# Altium schematic sheet 13 CPU_1.SchDoc
size 420 x 297 mm; Address1: Address1; Address2: Address2; Address3: Address3; Address4: Address4; DocumentNumber: АБВГ.123456.001 Э3; SheetNumber: 13; SheetTotal: 23; Scale: 1:1; DocumentType: Схема электрическая принципиальная; FirstReferrence: АБВГ.123456.001
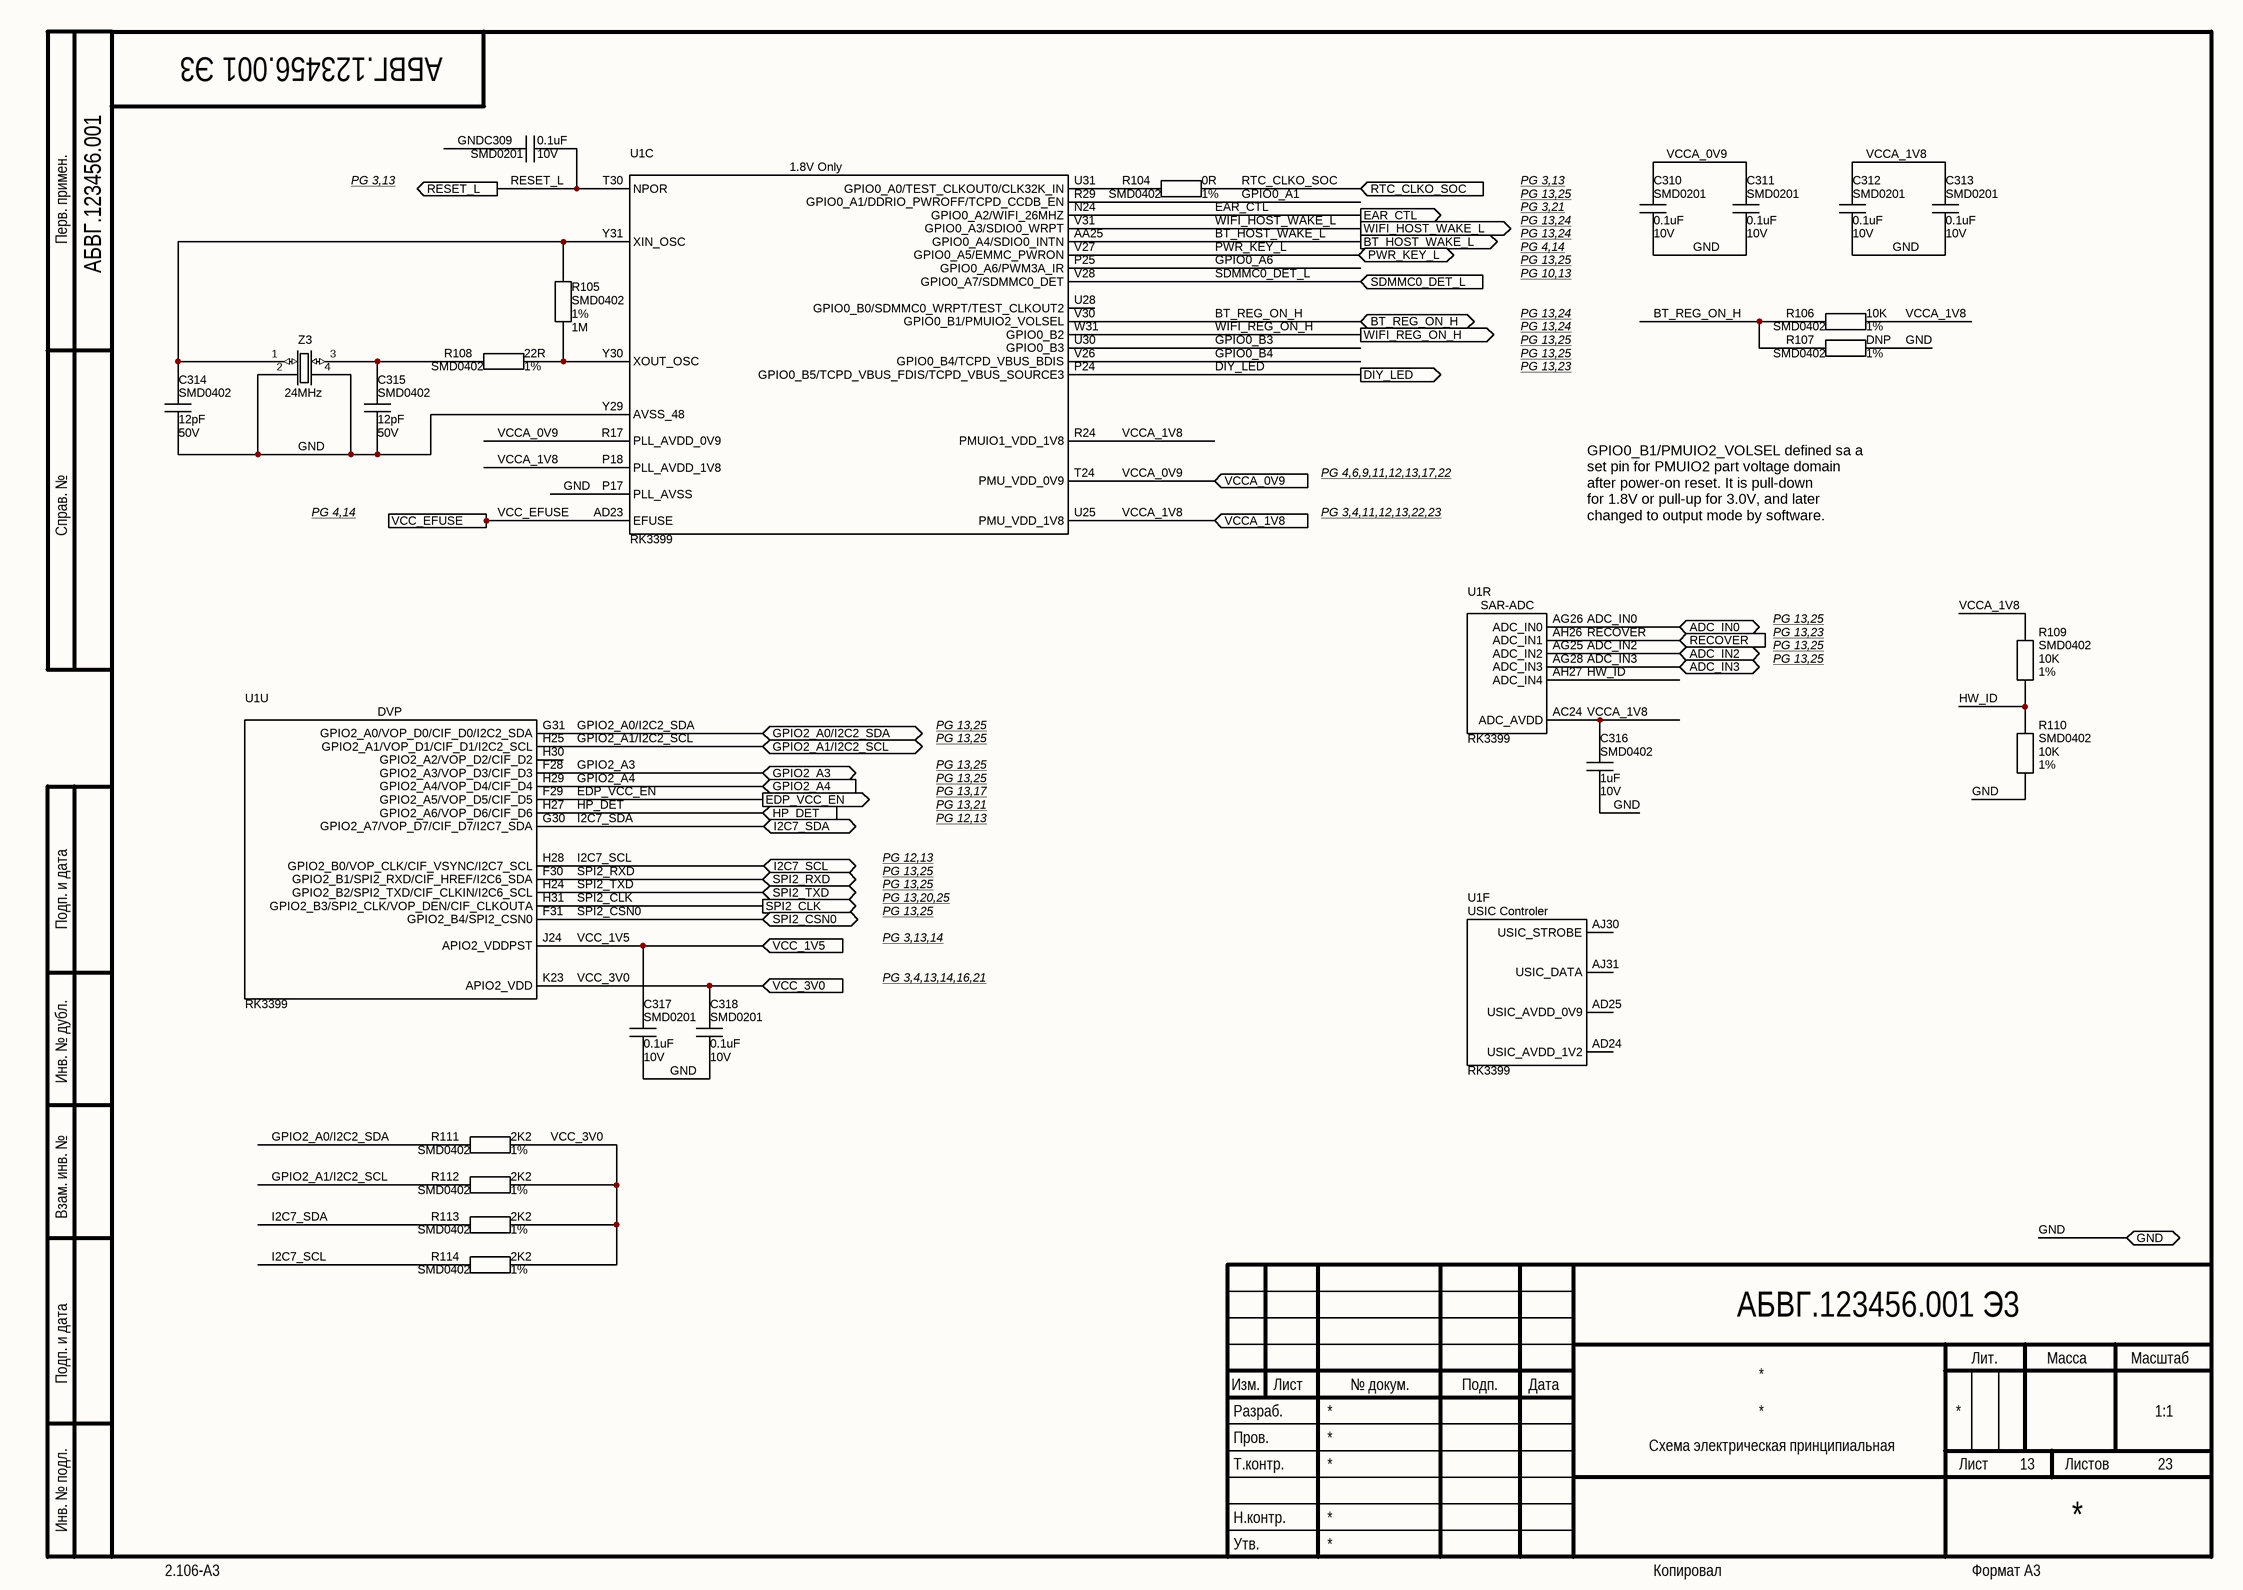
[diagram p0: 13 CPU_1.SchDoc]

## Parts
C309  Package: SMD0201  Voltage: 10V  [CAP_SMD_0201]  (hidden comment: 0.1uF)
C310  Package: SMD0201  Voltage: 10V  [CAP_SMD_0201]  (hidden comment: 0.1uF)
C311  Package: SMD0201  Voltage: 10V  [CAP_SMD_0201]  (hidden comment: 0.1uF)
C312  Package: SMD0201  Voltage: 10V  [CAP_SMD_0201]  (hidden comment: 0.1uF)
C313  Package: SMD0201  Voltage: 10V  [CAP_SMD_0201]  (hidden comment: 0.1uF)
C314  Package: SMD0402  Voltage: 50V  [CAP_SMD_0402]  (hidden comment: 12pF)
C315  Package: SMD0402  Voltage: 50V  [CAP_SMD_0402]  (hidden comment: 12pF)
C316  Package: SMD0402  Voltage: 10V  [CAP_SMD_0402_small]  (hidden comment: 1uF)
C317  Package: SMD0201  Voltage: 10V  [CAP_SMD_0201]  (hidden comment: 0.1uF)
C318  Package: SMD0201  Voltage: 10V  [CAP_SMD_0201]  (hidden comment: 0.1uF)
R104  Package: SMD0402  Tolerance: 1%  [RES_SMD_0402]  (hidden comment: 0R)
R105  Package: SMD0402  Tolerance: 1%  [RES_SMD_0402]  (hidden comment: 1M)
R106  Package: SMD0402  Tolerance: 1%  [RES_SMD_0402]  (hidden comment: 10K)
R107  Package: SMD0402  Tolerance: 1%  [RES_SMD_0402]  (hidden comment: DNP)
R108  Package: SMD0402  Tolerance: 1%  [RES_SMD_0402]  (hidden comment: 22R)
R109  Package: SMD0402  Tolerance: 1%  [RES_SMD_0402]  (hidden comment: 10K)
R110  Package: SMD0402  Tolerance: 1%  [RES_SMD_0402]  (hidden comment: 10K)
R111  Package: SMD0402  Tolerance: 1%  [RES_SMD_0402]  (hidden comment: 2K2)
R112  Package: SMD0402  Tolerance: 1%  [RES_SMD_0402]  (hidden comment: 2K2)
R113  Package: SMD0402  Tolerance: 1%  [RES_SMD_0402]  (hidden comment: 2K2)
R114  Package: SMD0402  Tolerance: 1%  [RES_SMD_0402]  (hidden comment: 2K2)
U1  value RK3399  [BGA828C65P31X31_2100X2100X161N]  (hidden comment: RK3399_FF)  (parts C,F,R,U of 23)
Z3  value 24MHz  [TSX3225]  (hidden comment: Value)

## Ports
ADC_IN0 (bidir), ADC_IN2 (bidir), ADC_IN3 (bidir), BT_HOST_WAKE_L (out), BT_REG_ON_H (bidir), DIY_LED (out), EAR_CTL (out), EDP_VCC_EN (out), GND (bidir), GPIO2_A0/I2C2_SDA (bidir), GPIO2_A1/I2C2_SCL (bidir), GPIO2_A3 (bidir), GPIO2_A4 (in), HP_DET (in), I2C7_SCL (bidir), I2C7_SDA (bidir), PWR_KEY_L (bidir), RECOVER (in), RESET_L (out), RTC_CLKO_SOC (in), SDMMC0_DET_L (in), SPI2_CLK (out), SPI2_CSN0 (bidir), SPI2_RXD (bidir), SPI2_TXD (bidir), VCC_1V5 (in), VCC_3V0 (in), VCC_EFUSE (in), VCCA_0V9 (in), VCCA_1V8 (in), WIFI_HOST_WAKE_L (out), WIFI_REG_ON_H (out)

## Nets
ADC_IN0: U1.AG26(ADC_IN0) ; port ADC_IN0
ADC_IN2: U1.AG25(ADC_IN2) ; port ADC_IN2
ADC_IN3: U1.AG28(ADC_IN3) ; port ADC_IN3
BT_HOST_WAKE_L: U1.AA25(GPIO0_A4/SDIO0_INTN) ; port BT_HOST_WAKE_L
BT_REG_ON_H: R106.2 R107.1 U1.V30(GPIO0_B1/PMUIO2_VOLSEL) ; port BT_REG_ON_H
DIY_LED: U1.P24(GPIO0_B5/TCPD_VBUS_FDIS/TCPD_VBUS_SOURCE3) ; port DIY_LED
EAR_CTL: U1.N24(GPIO0_A2/WIFI_26MHZ) ; port EAR_CTL
EDP_VCC_EN: U1.F29(GPIO2_A5/VOP_D5/CIF_D5) ; port EDP_VCC_EN
GND: C309.1 C310.2 C311.2 C312.2 C313.2 C314.2 C315.2 C316.2 C317.2 C318.2 R107.2 R110.1 U1.P17(PLL_AVSS) U1.Y29(AVSS_48) Z3.2(GND) Z3.4(GND) ; port GND
GPIO0_A1: U1.R29(GPIO0_A1/DDRIO_PWROFF/TCPD_CCDB_EN)
GPIO0_A6: U1.P25(GPIO0_A6/PWM3A_IR)
GPIO0_B3: U1.U30(GPIO0_B3)
GPIO0_B4: U1.V26(GPIO0_B4/TCPD_VBUS_BDIS)
GPIO2_A0/I2C2_SDA: R111.2 U1.G31(GPIO2_A0/VOP_D0/CIF_D0/I2C2_SDA) ; port GPIO2_A0/I2C2_SDA
GPIO2_A1/I2C2_SCL: R112.2 U1.H25(GPIO2_A1/VOP_D1/CIF_D1/I2C2_SCL) ; port GPIO2_A1/I2C2_SCL
GPIO2_A3: U1.F28(GPIO2_A3/VOP_D3/CIF_D3) ; port GPIO2_A3
GPIO2_A4: U1.H29(GPIO2_A4/VOP_D4/CIF_D4) ; port GPIO2_A4
HP_DET: U1.H27(GPIO2_A6/VOP_D6/CIF_D6) ; port HP_DET
HW_ID: R109.1 R110.2 U1.AH27(ADC_IN4)
I2C7_SCL: R114.2 U1.H28(GPIO2_B0/VOP_CLK/CIF_VSYNC/I2C7_SCL) ; port I2C7_SCL
I2C7_SDA: R113.2 U1.G30(GPIO2_A7/VOP_D7/CIF_D7/I2C7_SDA) ; port I2C7_SDA
PWR_KEY_L: U1.V27(GPIO0_A5/EMMC_PWRON) ; port PWR_KEY_L
RECOVER: U1.AH26(ADC_IN1) ; port RECOVER
RESET_L: C309.2 U1.T30(NPOR) ; port RESET_L
RTC_CLKO_SOC: R104.2 ; port RTC_CLKO_SOC
SDMMC0_DET_L: U1.V28(GPIO0_A7/SDMMC0_DET) ; port SDMMC0_DET_L
SPI2_CLK: U1.H31(GPIO2_B3/SPI2_CLK/VOP_DEN/CIF_CLKOUTA) ; port SPI2_CLK
SPI2_CSN0: U1.F31(GPIO2_B4/SPI2_CSN0) ; port SPI2_CSN0
SPI2_RXD: U1.F30(GPIO2_B1/SPI2_RXD/CIF_HREF/I2C6_SDA) ; port SPI2_RXD
SPI2_TXD: U1.H24(GPIO2_B2/SPI2_TXD/CIF_CLKIN/I2C6_SCL) ; port SPI2_TXD
VCC_1V5: C317.1 U1.J24(APIO2_VDDPST) ; port VCC_1V5
VCC_3V0: C318.1 R111.1 R112.1 R113.1 R114.1 U1.K23(APIO2_VDD) ; port VCC_3V0
VCC_EFUSE: U1.AD23(EFUSE) ; port VCC_EFUSE
VCCA_0V9: C310.1 C311.1 U1.R17(PLL_AVDD_0V9) U1.T24(PMU_VDD_0V9) ; port VCCA_0V9
VCCA_1V8: C312.1 C313.1 C316.1 R106.1 R109.2 U1.AC24(ADC_AVDD) U1.P18(PLL_AVDD_1V8) U1.R24(PMUIO1_VDD_1V8) U1.U25(PMU_VDD_1V8) ; port VCCA_1V8
WIFI_HOST_WAKE_L: U1.V31(GPIO0_A3/SDIO0_WRPT) ; port WIFI_HOST_WAKE_L
WIFI_REG_ON_H: U1.W31(GPIO0_B2) ; port WIFI_REG_ON_H
NetC314_1: C314.1 R105.2 U1.Y31(XIN_OSC) Z3.1(IN/OUT)
NetC315_1: C315.1 R108.2 Z3.3(IN/OUT)
NetR104_1: R104.1 U1.U31(GPIO0_A0/TEST_CLKOUT0/CLK32K_IN)
NetR105_1: R105.1 R108.1 U1.Y30(XOUT_OSC)

Not connected (* = marked no-connect by the designer): U1 AD24(USIC_AVDD_1V2) AD25(USIC_AVDD_0V9) AJ30(USIC_STROBE) AJ31(USIC_DATA) H30(GPIO2_A2/VOP_D2/CIF_D2) U28(GPIO0_B0/SDMMC0_WRPT/TEST_CLKOUT2)

## Notes on the sheet
- PG 3,13
- Перв. примен.
- PG 4,14
- PG 3,21
- PG 13,24
- PG 13,25
- PG 10,13
- PG 13,23
- Справ. №
- PG 3,4,11,12,13,22,23
- PG 4,6,9,11,12,13,17,22
- GPIO0_B1/PMUIO2_VOLSEL defined sa a
  set pin for PMUIO2 part voltage domain
  after power-on reset. It is pull-down
  for 1.8V or pull-up for 3.0V, and later
  changed to output mode by software.
- PG 13,17
- PG 12,13
- PG 13,21
- Подп. и дата
- PG 13,20,25
- PG 3,13,14
- PG 3,4,13,14,16,21
- Инв. № дубл.
- Взам. инв. №
- Разраб.
- Изм.
- Лист
- № докум.
- Подп.
- Дата
- Лит.
- Масса
- Масштаб
- Пров.
- Т.контр.
- Листов
- Инв. № подл.
- Утв.
- Н.контр.
- 2.106-A3
- Копировал
- Формат А3
- (in symbol RK3399_FF, part C) 1.8V Only
- (in symbol RK3399_FF, part F) USIC Controler
- (in symbol RK3399_FF, part R) SAR-ADC
- (in symbol RK3399_FF, part U) DVP

## Library data of the parts
C309-C313 C317 C318 = Ceramic_Cap: PartNumber: CC0201KRX5R6BB104; ComponentType: SMD Ceramic Chip Capacitor; Manufacter: *; Tolerance: *; ClassName: *; Value: 0.1uF
C314 C315 = Ceramic_Cap: PartNumber: CC0402JRNPO9BN120; ComponentType: SMD Ceramic Chip Capacitor; Manufacter: *; Tolerance: *; ClassName: *; Value: 12pF
C316 = Ceramic_Cap: PartNumber: CC0402KRX5R6BB105; ComponentType: SMD Ceramic Chip Capacitor; Manufacter: *; Tolerance: *; ClassName: Solder_Clearence; Value: 1uF
R104 = Chip_Res: PartNumber: RC0402FR-070RL; ComponentType: SMD Chip Resistor; Manufacter: *; Voltage: *; ClassName: *; Value: 0R
R105 = Chip_Res: PartNumber: RC0402FR-071ML; ComponentType: SMD Chip Resistor; Manufacter: *; Voltage: *; ClassName: *; Value: 1M
R106 R109 R110 = Chip_Res: PartNumber: RC0402FR-0710KL; ComponentType: SMD Chip Resistor; Manufacter: *; Voltage: *; ClassName: *; Value: 10K
R107 = Chip_Res: PartNumber: Do Not Place; ComponentType: SMD Chip Resistor; Manufacter: *; Voltage: *; ClassName: *; Value: DNP
R108 = Chip_Res: PartNumber: RC0402FR-0722RL; ComponentType: SMD Chip Resistor; Manufacter: *; Voltage: *; ClassName: *; Value: 22R
R111-R114 = Chip_Res: PartNumber: RC0402FR-072K2L; ComponentType: SMD Chip Resistor; Manufacter: *; Voltage: *; ClassName: *; Value: 2K2
Z3 = OSC3225: PartNumber: 12.88665; ComponentType: *; Manufacter: *; Package: TSX3225
U1 = RK3399_FF: Package: BGA828; ComponentType: *; Manufacter: *; PartNumber: RK3399; ClassName: *